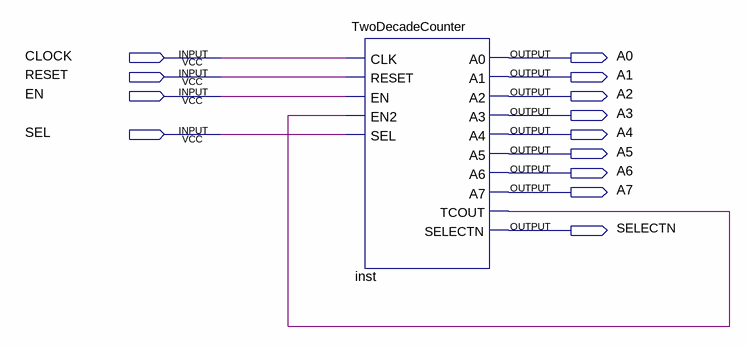
[diagram p0: schematic sheet]
// Quartus schematic LAB6.bdf as structural Verilog: 1 symbols, 13 pins
module LAB6 (
  input  CLOCK,
  input  RESET,
  input  EN,
  input  SEL,
  output A0,
  output A1,
  output A2,
  output A3,
  output A4,
  output A5,
  output A6,
  output A7,
  output SELECTN
);

  wire inst_tcout;

  TwoDecadeCounter inst (
    .CLK(CLOCK), .RESET(RESET), .EN(EN), .EN2(inst_tcout), .SEL(SEL), .A0(A0), .A1(A1), .A2(A2), .A3(A3),
    .A4(A4), .A5(A5), .A6(A6), .A7(A7), .TCOUT(inst_tcout), .SELECTN(SELECTN));
endmodule
